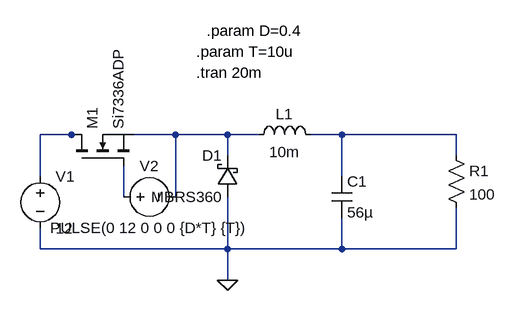
[diagram p0: schematic buck.asc]
buck.asc, the LTspice schematic file:
Version 4
SHEET 1 880 680
WIRE -112 128 -160 128
WIRE -96 128 -112 128
WIRE 48 128 -16 128
WIRE 128 128 48 128
WIRE 176 128 128 128
WIRE 304 128 256 128
WIRE 480 128 304 128
WIRE 128 160 128 128
WIRE 480 160 480 128
WIRE -160 192 -160 128
WIRE 304 192 304 128
WIRE -32 224 -32 176
WIRE 48 224 48 128
WIRE -160 304 -160 272
WIRE 128 304 128 224
WIRE 128 304 -160 304
WIRE 304 304 304 256
WIRE 304 304 128 304
WIRE 480 304 480 240
WIRE 480 304 304 304
WIRE 128 352 128 304
FLAG 128 352 0
SYMBOL schottky 144 224 R180
WINDOW 0 24 64 Left 2
WINDOW 3 24 0 Left 2
SYMATTR InstName D1
SYMATTR Value MBRS360
SYMATTR Description Diode
SYMATTR Type diode
SYMBOL cap 288 192 R0
SYMATTR InstName C1
SYMATTR Value 56µ
SYMATTR SpiceLine Rser=0
SYMBOL voltage -160 176 R0
WINDOW 123 0 0 Left 0
WINDOW 39 0 0 Left 0
SYMATTR InstName V1
SYMATTR Value 12
SYMBOL nmos -112 176 R270
SYMATTR InstName M1
SYMATTR Value Si7336ADP
SYMBOL voltage -48 224 R270
WINDOW 0 32 56 VTop 2
WINDOW 3 -32 56 VBottom 2
WINDOW 123 0 0 Left 0
WINDOW 39 0 0 Left 0
SYMATTR InstName V2
SYMATTR Value PULSE(0 12 0 0 0 {D*T} {T})
SYMBOL res 464 144 R0
SYMATTR InstName R1
SYMATTR Value 100
SYMBOL ind 160 144 R270
WINDOW 0 32 56 VTop 2
WINDOW 3 5 56 VBottom 2
SYMATTR InstName L1
SYMATTR Value 10m
SYMATTR SpiceLine Rser=0
TEXT 80 32 Left 2 !.tran 20m
TEXT 80 0 Left 2 !.param T=10u
TEXT 96 -32 Left 2 !.param D=0.4

The netlist it stands for:
* buck.asc
D1 0 N002 MBRS360
C1 N003 0 56µ Rser=0
V1 N001 0 12
M1 N001 N004 N002 N002 Si7336ADP
V2 N004 N002 PULSE(0 12 0 0 0 {D*T} {T})
R1 N003 0 100
L1 N002 N003 10m Rser=0
.model D D
.lib standard.dio
.model NMOS NMOS
.model PMOS PMOS
.lib standard.mos
.tran 20m
.param T=10u
.param D=0.4
.backanno
.end